# EAGLE schematic FreedomWingSMD (EAGLE 9.6.2)
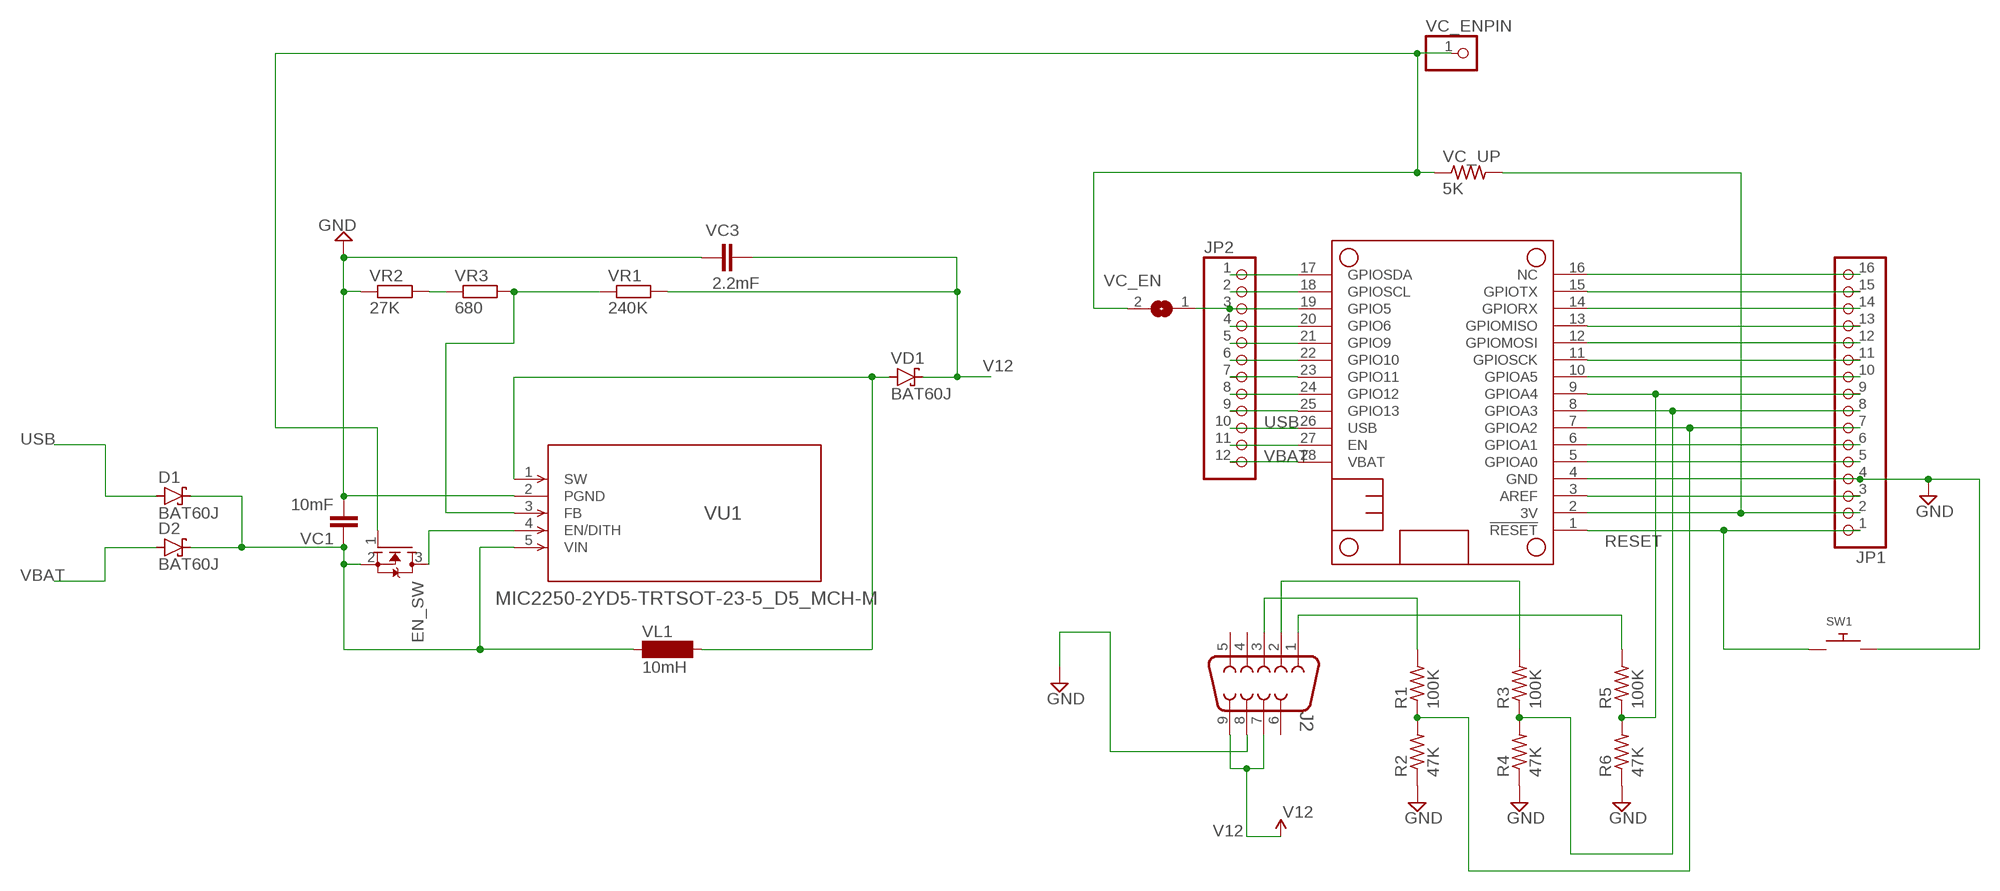
[diagram p0: schematic, sheet 1]

## Parts
D1  BAT60J  [SOD323_ST]
D2  BAT60J  [SOD323_ST]
EN_SW  MOSFET-NREFLOW  [SOT23]
J2  DB9MALE  [DB9_MALE]
JP1  PINHD-1X16  [1X16]
JP2  PINHD-1X12  [1X12]
MS1  FEATHERWING_NODIM  [FEATHERWING_DIM]
R1  100K  R-US_R0805  [R0805]
R2  47K  R-US_R0805  [R0805]
R3  100K  R-US_R0805  [R0805]
R4  47K  R-US_R0805  [R0805]
R5  100K  R-US_R0805  [R0805]
R6  47K  R-US_R0805  [R0805]
SW1  SWITCH_PUSHBUTTONC&K_KSS  [BTN_CK_KSS]
VC1  10mF  C-EUC0805  [C0805]
VC3  2.2mF  C-EUC0805  [C0805]
VC_EN  SJW  [SJW]
VC_ENPIN  PINHD-1X1  [1X01]
VC_UP  5K  R-US_R0805  [R0805]
VD1  BAT60J  [SOD323_ST]
VL1  10mH  MS50  [MS50]
VR1  240K  R-EU_R0805W  [R0805W]
VR2  27K  R-EU_R0805W  [R0805W]
VR3  680  R-EU_R0805W  [R0805W]
VU1  MIC2250-2YD5-TRTSOT-23-5_D5_MCH-M  [TSOT-23-5_D5_MCH-M]

## Nets
3V: JP1.2 MS1.2(3V) VC_UP.2
GND: J2.8 JP1.4 MS1.4(GND) R2.1 R4.1 R6.1 SW1.P$2 VC1.2 VC3.1 VR2.1 VU1.2(PGND)
N$1: J2.3 R1.2
N$2: JP2.1 MS1.17(GPIOSDA)
N$3: JP2.2 MS1.18(GPIOSCL)
N$4: JP2.3 MS1.19(GPIO5) VC_EN.1
N$5: JP1.7 MS1.7(GPIOA2) R1.1 R2.2
N$6: JP1.8 MS1.8(GPIOA3) R3.1 R4.2
N$7: JP1.9 MS1.9(GPIOA4) R5.1 R6.2
N$8: VR1.1 VR3.2 VU1.3(FB)
N$9: J2.2 R3.2
N$10: J2.1 R5.2
N$11: JP2.4 MS1.20(GPIO6)
N$12: JP2.5 MS1.21(GPIO9)
N$13: JP2.6 MS1.22(GPIO10)
N$14: JP2.7 MS1.23(GPIO11)
N$15: JP2.8 MS1.24(GPIO12)
N$16: JP2.9 MS1.25(GPIO13)
N$17: JP1.10 MS1.10(GPIOA5)
N$18: JP1.16 MS1.16(NC)
N$19: JP1.15 MS1.15(GPIOTX)
N$20: JP1.14 MS1.14(GPIORX)
N$21: JP1.13 MS1.13(GPIOMISO)
N$22: JP1.12 MS1.12(GPIOMOSI)
N$23: JP1.11 MS1.11(GPIOSCK)
N$24: JP2.11 MS1.27(EN)
N$25: EN_SW.3(D) VU1.4(EN/DITH)
N$26: VD1.A VL1.2 VU1.1(SW)
N$27: JP1.3 MS1.3(AREF)
N$28: EN_SW.1(G) VC_EN.2 VC_ENPIN.1 VC_UP.1
N$29: JP1.6 MS1.6(GPIOA1)
N$30: JP1.5 MS1.5(GPIOA0)
N$31: VR2.2 VR3.1
RESET: JP1.1 MS1.1(!RESET) SW1.P$1
USB: D1.A JP2.10 MS1.26(USB)
V12: J2.7 J2.9 VC3.2 VD1.C VR1.2
VBAT: D2.A JP2.12 MS1.28(VBAT)
VMAX: D1.C D2.C EN_SW.2(S) VC1.1 VL1.1 VU1.5(VIN)
Unconnected: J2.4 J2.5 J2.6

## Library data of the parts
D1 D2 VD1 = diode:BAT60J: Schottky barrier diode Source: www.st.com, BAT60J.pdf
EN_SW = adafruit:MOSFET-N: N-Channel Mosfet 2N7002E - 60V 260mA SOT23 [Digikey: 2N7002ET1GOSTR-ND] - REEL BSH103 - 30V 850mA SOT23 [Digikey: 568-5013-1-ND]
J2 = SparkFun-Connectors:DB9: DB9 Connector Standard DB9 (D-Sub 9) serial connector. Can be used for CAN bus as well as RS485 and RS232. Footprint production proven. Here is the female version connector we sell at SparkFun: 9 Pin Female Serial Connector - PCB Mount <https://www.sparkfun.com/products/429> (PRT-00429) This connector has been used on the following SparkFun products: SparkFun RS232 Shifter - SMD <https://www.sparkfun.com/products/449> (PRT-00449) SparkFun RS232 Shifter SMD (No DB9) <https://www.sparkfun.com/products/8780> (PRT-08780); PROD_ID: CONN-09904
JP1 = pinhead:PINHD-1X16: PIN HEADER
JP2 = pinhead:PINHD-1X12: PIN HEADER
MS1 = adafruit:FEATHERWING
R1-R6 VC_UP = adafruit:R-US_: RESISTOR, American symbol
SW1 = adafruit:SWITCH_PUSHBUTTON: Buttons SOFTTOUCHSMD_SJ - Soft touch temporary push button (Super Junk Akihabara) Compatible with SKPMANE010 [Mouser: 688-SKPMAN] C&K_KSS = Digikey: KSS221GLFS
VC1 VC3 = rcl:C-EU: CAPACITOR, European symbol; SPICEPREFIX: C
VC_EN = jumper:SJ: SMD solder JUMPER
VC_ENPIN = adafruit:PINHD-1X1: Pin header 1x1 for 0.1" spacing With round pins
VL1 = inductor-neosid:MS50: INDUCTOR SMD power inductor; OC_FARNELL: unknown; OC_NEWARK: unknown
VR1-VR3 = rcl:R-EU_: RESISTOR, European symbol; SPICEPREFIX: R
VU1 = ATMakers:MIC2250-2YD5-TR; BUILT_BY: EMA_Jessica; COPYRIGHT: Copyright (C) 2018 Accelerated Designs. All rights reserved; MANUFACTURER_PART_NUMBER: MIC2250-2YD5-TR; SOURCELIBRARY: Microchip_2019-08-23_2; VENDOR: Microchip